# Altium schematic sheet 3.3VBuck.SchDoc
size A
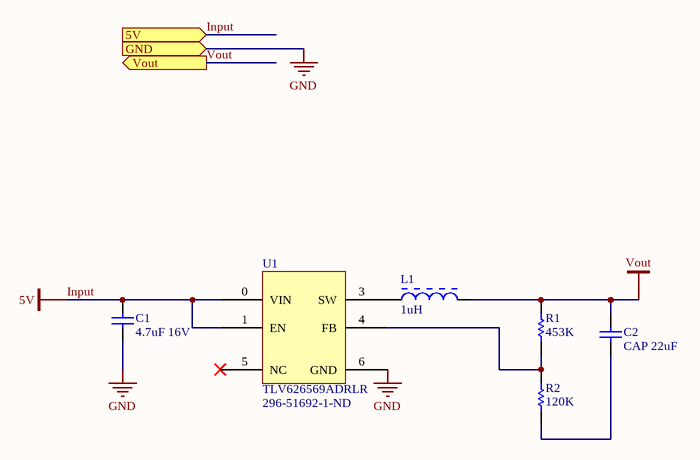
[diagram p0: 3.3VBuck.SchDoc]

## Parts
C1  4.7uF 16V  [CAPC0805(2012)145_N]
C2  CAP 22uF  [CAPC0805(2012)100_L]
L1  1uH  [BOUR-SDR0403-2_V]
R1  453K  [RESC0805(2012)_M]
R2  120K  [RESC0805(2012)_N]
U1  TLV626569ADRLR  Supplier Part Number 1: 296-51692-1-ND  [*SOT50P160X60-6N]

## Ports
5V (in), GND (in), Vout (out)

## Nets
GND: C1.1 U1.6(GND) ; port GND
Input: C1.2 U1.0(VIN) U1.1(EN) ; port 5V  [also labelled 5V]
Vout: C2.2 L1.2 R1.2 ; port Vout
NetC2_1: C2.1 R2.1
NetL1_1: L1.1 U1.3(SW)
NetR1_1: R1.1 R2.2 U1.4(FB)

Not connected (* = marked no-connect by the designer): U1 5(NC)*

## Library data of the parts
C1 = CMP-1036-04889-1: CAP 4.7uF 16V ±10% 0805 (2012 Metric) Thickness 1.45mm SMD; Case-EIA: 0805; Case-Metric: 2012; Tolerance: Â±10%; Technology: SMT; Value: 4.7uF; Rated Voltage: 16 V; Max Thickness: 1.45 mm
C2 = CMP-1036-04944-1: CAP 22uF 10V ±20% 0805 (2012 Metric) Thickness 1mm SMD; Case-Metric: 2012; Case-EIA: 0805; Tolerance: Â±20%; Technology: SMT; Max Thickness: 1 mm; Value: 22uF; Rated Voltage: 10 V
L1 = CMP-0904-00016-1: SDR0403 Series Power Inductor, 1 uF +/- 20 %, 0.033 Ohm, -40 to 125 degC, 2-Pin SMD, RoHS, Tape and Reel; Manufacturer: Bourns; PartNumber: SDR0403-1R0ML; RDC (Ohm): 0.033 Max.; SRF (MHz): 150 Min.; I sat (A): 5.5 Typ.; Test Frequency (MHz): 7.96; Tolerance (%): +/- 20; Inductance (uH): 1; Q: 28; I rms (A): 3.8 Max.; PackageDescription: 3-Pin SMD, Dia 4.5 mm, Height 3.5 mm; Packing: Tape and Reel; PackageReference: SDR0403-2; ComponentLink1Description: Manufacturer URL; Temperature Range: -40 to 125 degC; DatasheetVersion: Feb-12; ComponentLink1URL: http://www.bourns.com/; RoHS: TRUE; Mounting Technology: Surface Mount; ComponentLink2Description: Datasheet; ComponentLink2URL: http://www.bourns.com/data/global/pdfs/sdr0403.pdf
R1 = CMP-1013-00810-1: 453K 0.125W 1% 0805 (2012 Metric)  SMD; Value: 453000.00 Ohm; Case-Metric: 2012; Case-EIA: 0805; Tolerance: 1 %; Power: 0.125 W; Technology: SMT
R2 = CMP-1013-00124-1: 120K 0.125W 5% 0805 (2012 Metric)  SMD; Case-Metric: 2012; Value: 120000.00 Ohm; Case-EIA: 0805; Power: 0.125 W; Technology: SMT; Tolerance: 5 %
U1 = TLV626569ADRLR: Manufacturer: Texas Instruments; Manufacturer Part Number: TLV62569ADRLR; Supplier 1: Digi-Key; Stock 1: 1873; Pricing 1: 1 = 1.32000, 10 = 1.17600, 100 = 0.91680, 500 = 0.75736, 1000 = 0.59792 (USD)